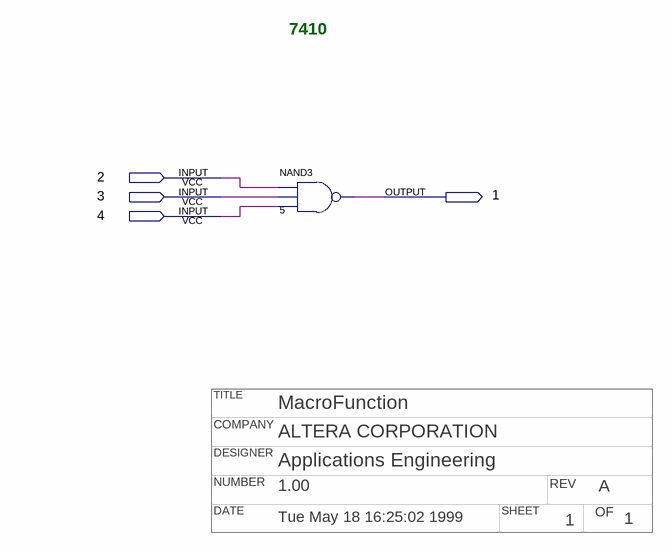
[diagram p0: schematic sheet]
// Quartus schematic 7410.bdf as structural Verilog: 1 symbols, 4 pins
// Title block: TITLE: MacroFunction; COMPANY: ALTERA CORPORATION; DESIGNER: Applications Engineering; NUMBER: 1.00; REV: A; DATE: Tue May 18 16:25:02 1999; SHEET: 1; OF: 1
module \7410  (
  input  \2 ,
  input  \3 ,
  input  \4 ,
  output \1 
);

  nand u_5 (\1 , \2 , \3 , \4 );

  // Notes on the sheet:
  //   7410
endmodule
